# EAGLE design roland_121_vcf (EAGLE 7.6.0)
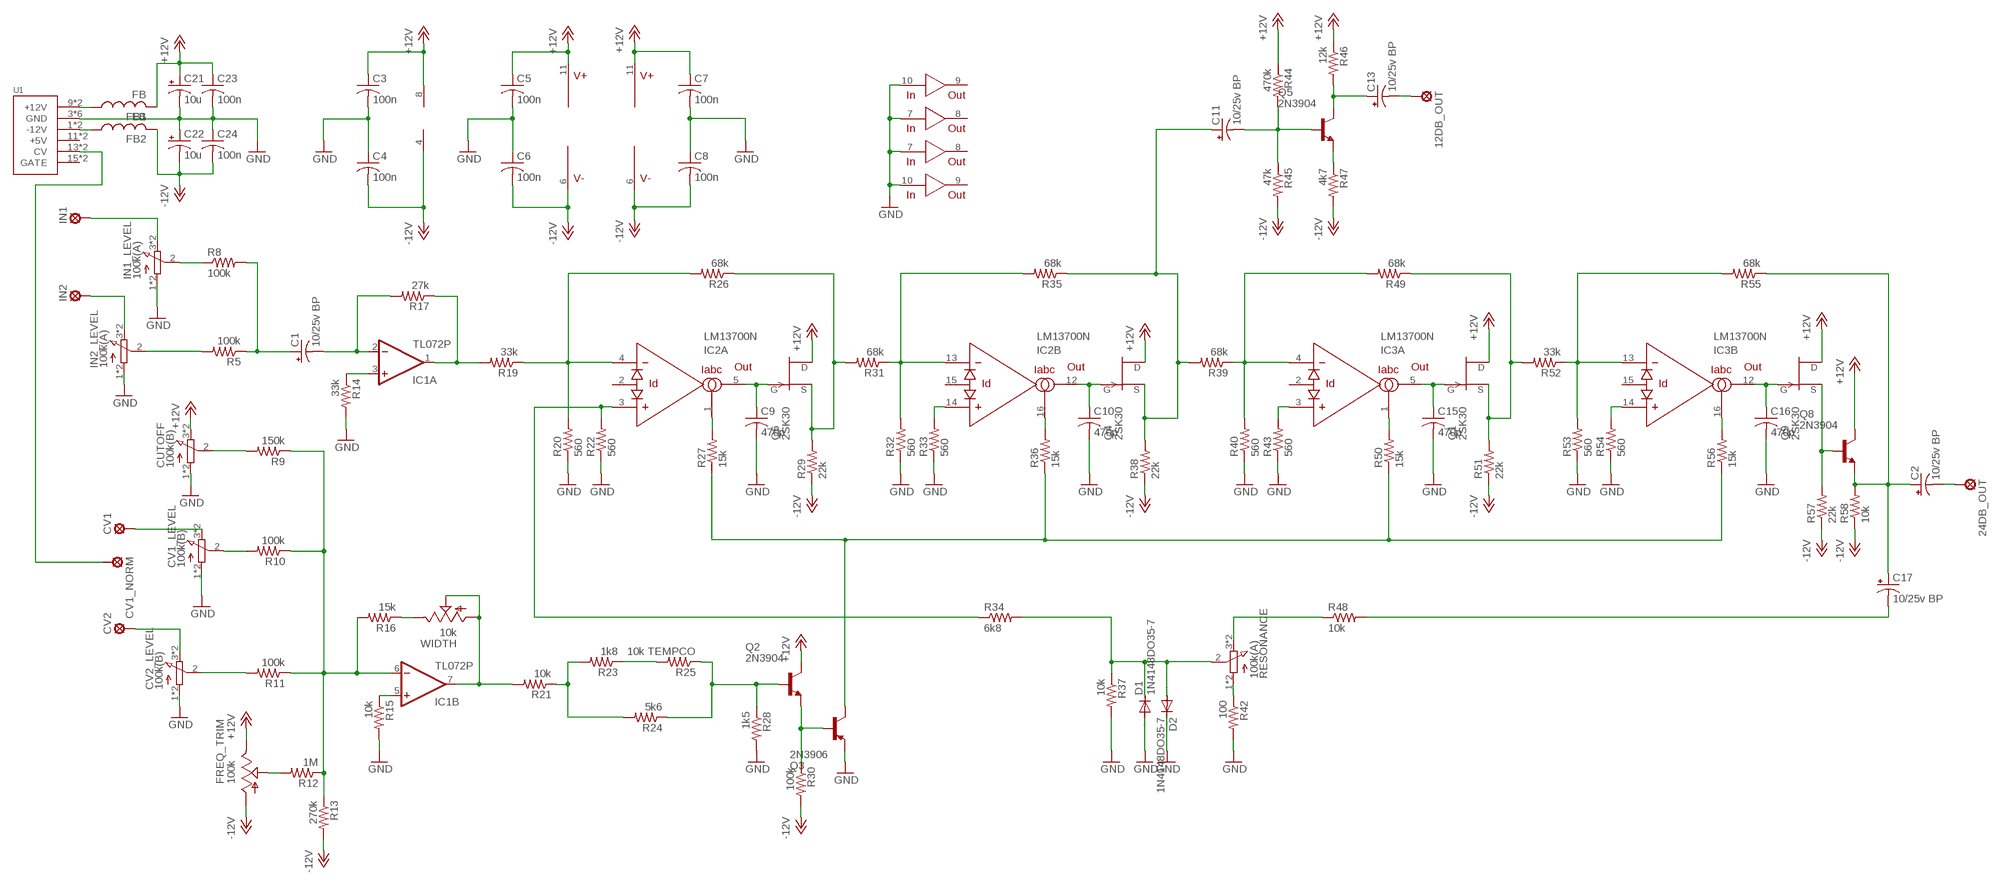
[diagram p0: schematic, sheet 1]

## Parts
12DB_OUT  LSP10  [LSP10]
24DB_OUT  LSP10  [LSP10]
C1  10/25v BP  CPOL-USB45181A  [B45181A]
C2  10/25v BP  CPOL-USB45181A  [B45181A]
C3  100n  C-USC1206  [C1206]
C4  100n  C-USC1206  [C1206]
C5  100n  C-USC1206  [C1206]
C6  100n  C-USC1206  [C1206]
C7  100n  C-USC1206  [C1206]
C8  100n  C-USC1206  [C1206]
C9  470p  C-US025-030X050  [C025-030X050]
C10  470p  C-US025-030X050  [C025-030X050]
C11  10/25v BP  CPOL-USB45181A  [B45181A]
C13  10/25v BP  CPOL-USB45181A  [B45181A]
C15  470p  C-US025-030X050  [C025-030X050]
C16  470p  C-US025-030X050  [C025-030X050]
C17  10/25v BP  CPOL-USB45181A  [B45181A]
C21  10u  CPOL-USB45181A  [B45181A]
C22  10u  CPOL-USB45181A  [B45181A]
C23  100n  C-US050-024X044  [C050-024X044]
C24  100n  C-US050-024X044  [C050-024X044]
CUTOFF  100k(B)  3RP/1610N  [3RP/1610N]
CV1  LSP10  [LSP10]
CV1_LEVEL  100k(B)  3RP/1610N  [3RP/1610N]
CV1_NORM  LSP10  [LSP10]
CV2  LSP10  [LSP10]
CV2_LEVEL  100k(B)  3RP/1610N  [3RP/1610N]
D1  1N4148DO35-7  [DO35-7]
D2  1N4148DO35-7  [DO35-7]
FB1  FB  [FB]
FB2  FB  [FB]
FREQ_TRIM  100k  TRIM_US-B64W  [B64W]
IC1  TL072P  [DIL08]
IC2  LM13700N  [DIL16]
IC3  LM13700N  [DIL16]
IN1  LSP10  [LSP10]
IN1_LEVEL  100k(A)  3RP/1610N  [3RP/1610N]
IN2  LSP10  [LSP10]
IN2_LEVEL  100k(A)  3RP/1610N  [3RP/1610N]
Q1  2SK30  [TO92]
Q2  2N3904  [TO92]
Q3  2N3906  [TO92]
Q4  2SK30  [TO92]
Q5  2N3904  [TO92]
Q6  2SK30  [TO92]
Q8  2N3904  [TO92]
Q9  2SK30  [TO92]
R5  100k  R-US_0207/7  [0207/7]
R8  100k  R-US_0207/7  [0207/7]
R9  150k  R-US_0207/7  [0207/7]
R10  100k  R-US_0207/7  [0207/7]
R11  100k  R-US_0207/7  [0207/7]
R12  1M  R-US_0207/7  [0207/7]
R13  270k  R-US_0207/7  [0207/7]
R14  33k  R-US_0207/7  [0207/7]
R15  10k  R-US_0207/7  [0207/7]
R16  15k  R-US_0207/7  [0207/7]
R17  27k  R-US_0207/7  [0207/7]
R19  33k  R-US_0207/7  [0207/7]
R20  560  R-US_0207/7  [0207/7]
R21  10k  R-US_0207/7  [0207/7]
R22  560  R-US_0207/7  [0207/7]
R23  1k8  R-US_0207/7  [0207/7]
R24  5k6  R-US_0207/7  [0207/7]
R25  10k TEMPCO  R-US_0207/7  [0207/7]
R26  68k  R-US_0207/7  [0207/7]
R27  15k  R-US_0207/7  [0207/7]
R28  1k5  R-US_0207/7  [0207/7]
R29  22k  R-US_0207/7  [0207/7]
R30  100k  R-US_0207/7  [0207/7]
R31  68k  R-US_0207/7  [0207/7]
R32  560  R-US_0207/7  [0207/7]
R33  560  R-US_0207/7  [0207/7]
R34  6k8  R-US_0207/7  [0207/7]
R35  68k  R-US_0207/7  [0207/7]
R36  15k  R-US_0207/7  [0207/7]
R37  10k  R-US_0207/7  [0207/7]
R38  22k  R-US_0207/7  [0207/7]
R39  68k  R-US_0207/7  [0207/7]
R40  560  R-US_0207/7  [0207/7]
R42  100  R-US_0207/7  [0207/7]
R43  560  R-US_0207/7  [0207/7]
R44  470k  R-US_0207/7  [0207/7]
R45  47k  R-US_0207/7  [0207/7]
R46  12k  R-US_0207/7  [0207/7]
R47  4k7  R-US_0207/7  [0207/7]
R48  10k  R-US_0207/7  [0207/7]
R49  68k  R-US_0207/7  [0207/7]
R50  15k  R-US_0207/7  [0207/7]
R51  22k  R-US_0207/7  [0207/7]
R52  33k  R-US_0207/7  [0207/7]
R53  560  R-US_0207/7  [0207/7]
R54  560  R-US_0207/7  [0207/7]
R55  68k  R-US_0207/7  [0207/7]
R56  15k  R-US_0207/7  [0207/7]
R57  22k  R-US_0207/7  [0207/7]
R58  10k  R-US_0207/7  [0207/7]
RESONANCE  100k(A)  3RP/1610N  [3RP/1610N]
U1  POWER  [POWER_16]
WIDTH  10k  TRIM_US-B64W  [B64W]

## Nets
+12V: C3.1 C5.1 C7.1 C21.+ C23.1 CUTOFF.3(E) CUTOFF.6(E) FB1.P$2 FREQ_TRIM.E IC1.8(P:V+) IC2.11(V+) IC3.11(V+) Q1.1(D) Q2.1(C) Q4.1(D) Q6.1(D) Q8.1(C) Q9.1(D) R44.1 R46.1
-12V: C4.2 C6.2 C8.2 C22.- C24.2 FB2.P$2 FREQ_TRIM.A IC1.4(P:V-) IC2.6(V-) IC3.6(V-) R13.2 R29.1 R30.2 R38.1 R45.2 R47.2 R51.1 R57.1 R58.1
GND: C3.2 C4.1 C5.2 C6.1 C7.2 C8.1 C9.2 C10.2 C15.2 C16.2 C21.- C22.+ C23.2 C24.1 CUTOFF.1(A) CUTOFF.4(A) CV1_LEVEL.1(A) CV1_LEVEL.4(A) CV2_LEVEL.1(A) CV2_LEVEL.4(A) D1.A D2.C IC2.7(IN) IC2.10(IN) IC3.7(IN) IC3.10(IN) IN1_LEVEL.1(A) IN1_LEVEL.4(A) IN2_LEVEL.1(A) IN2_LEVEL.4(A) Q3.3(E) R14.2 R15.2 R20.1 R22.1 R28.2 R32.1 R33.1 R37.2 R40.1 R42.2 R43.1 R53.1 R54.1 U1.3(GND) U1.4(GND) U1.5(GND) U1.6(GND) U1.7(GND) U1.8(GND)
N$1: IC2.1(A:IABC) R27.2
N$2: IC2.16(B:IABC) R36.2
N$3: IC2.13(B:-IN) R31.1 R32.2 R35.2
N$4: IC2.14(B:+IN) R33.2
N$5: IN2_LEVEL.2(S) R5.2
N$6: C1.+ R5.1 R8.2
N$7: C1.- IC1.2(A:-IN) R17.2
N$8: IC1.1(A:OUT) R17.1 R19.2
N$9: R16.1 WIDTH.E
N$10: CV2_LEVEL.2(S) R11.2
N$11: IC1.3(A:+IN) R14.1
N$12: IC1.5(B:+IN) R15.1
N$14: IC3.1(A:IABC) R50.2
N$15: IC3.4(A:-IN) R39.1 R40.2 R49.2
N$16: IC1.6(B:-IN) R9.1 R10.1 R11.1 R12.1 R13.1 R16.2
N$17: FREQ_TRIM.P$1(S) FREQ_TRIM.S R12.2
N$18: R23.1 R25.2
N$19: R21.1 R23.2 R24.2
N$20: Q2.2(B) R24.1 R25.1 R28.1
N$21: Q2.3(E) Q3.2(B) R30.1
N$22: IC2.4(A:-IN) R19.1 R20.2 R26.2
N$23: IC2.3(A:+IN) R22.2 R34.1
N$24: IC3.3(A:+IN) R43.2
N$25: IC3.16(B:IABC) R56.2
N$26: IC3.13(B:-IN) R52.1 R53.2 R55.2
N$27: IC3.14(B:+IN) R54.2
N$28: Q6.3(S) R26.1 R29.2 R31.2
N$29: 24DB_OUT.MP C2.-
N$30: 12DB_OUT.MP C13.-
N$31: Q5.3(E) R47.1
N$32: C13.+ Q5.1(C) R46.2
N$33: C11.- Q5.2(B) R44.2 R45.1
N$34: IN2.MP IN2_LEVEL.3(E) IN2_LEVEL.6(E)
N$35: C11.+ Q4.3(S) R35.1 R38.2 R39.2
N$36: C2.+ C17.+ Q8.3(E) R55.1 R58.2
N$37: Q1.3(S) R49.1 R51.2 R52.2
N$38: IC1.7(B:OUT) R21.2 WIDTH.A WIDTH.P$1(S) WIDTH.S
N$40: C9.1 IC2.5(A:OUT) Q6.2(G)
N$41: C10.1 IC2.12(B:OUT) Q4.2(G)
N$42: C15.1 IC3.5(A:OUT) Q1.2(G)
N$43: C16.1 IC3.12(B:OUT) Q9.2(G)
N$45: Q3.1(C) R27.1 R36.1 R50.1 R56.1
N$47: Q8.2(B) Q9.3(S) R57.2
N$48: R42.1 RESONANCE.1(A) RESONANCE.4(A)
N$50: C17.- R48.2
N$51: R48.1 RESONANCE.3(E) RESONANCE.6(E)
N$52: D1.C D2.A R34.2 R37.1 RESONANCE.2(S)
N$53: CV1_LEVEL.2(S) R10.2
N$54: CV2.MP CV2_LEVEL.3(E) CV2_LEVEL.6(E)
N$55: CV1_NORM.MP U1.13(CV) U1.14(CV)
N$56: CUTOFF.2(S) R9.2
N$57: IN1_LEVEL.2(S) R8.1
N$58: IN1.MP IN1_LEVEL.3(E) IN1_LEVEL.6(E)
N$59: CV1.MP CV1_LEVEL.3(E) CV1_LEVEL.6(E)
N$61: FB1.P$1 U1.9(+12V) U1.10(+12V)
N$62: FB2.P$1 U1.1(-12V) U1.2(-12V)
Unconnected: IC2.2(A:ID) IC2.8(OUT) IC2.9(OUT) IC2.15(B:ID) IC3.2(A:ID) IC3.8(OUT) IC3.9(OUT) IC3.15(B:ID) U1.11(+5V) U1.12(+5V) U1.15(GATE) U1.16(GATE)

## Library data of the parts
12DB_OUT 24DB_OUT CV1 CV1_NORM CV2 IN1 IN2 = solpad:LSP10: SOLDER PAD drill 1.0 mm, distributor Buerklin, 12H555
C1 C2 C11 C13 C17 C21 C22 = rcl:CPOL-US: POLARIZED CAPACITOR, American symbol
C3-C10 C15 C16 C23 C24 = rcl:C-US: CAPACITOR, American symbol
CUTOFF CV1_LEVEL CV2_LEVEL IN1_LEVEL IN2_LEVEL RESONANCE = pot:3RP/1610N: 16mm Potentiometer one level Source: http://www.alphapotentiometers.net/html/16mm_pot_2.html
D1 D2 = diode:1N4148: DIODE high speed (Philips)
FB1 FB2 = adafruit:FB: Ferrite bead Digikey #P9821BK-ND
FREQ_TRIM WIDTH = pot:TRIM_US-: POTENTIOMETER
IC1 = linear:TL072: OP AMP
IC2 IC3 = synthdiy updated imperial:LM13700: National Dual OTA with buffers.
Q1 Q4 Q6 Q9 = 808:2SK30
Q2 Q5 Q8 = transistor-npn:2N3904: NPN Transistor
Q3 = transistor-pnp:2N3906: PNP Transistor
R5 R8-R17 R19-R40 R42-R58 = rcl:R-US_: RESISTOR, American symbol
U1 = eurorack:POWER

## Board
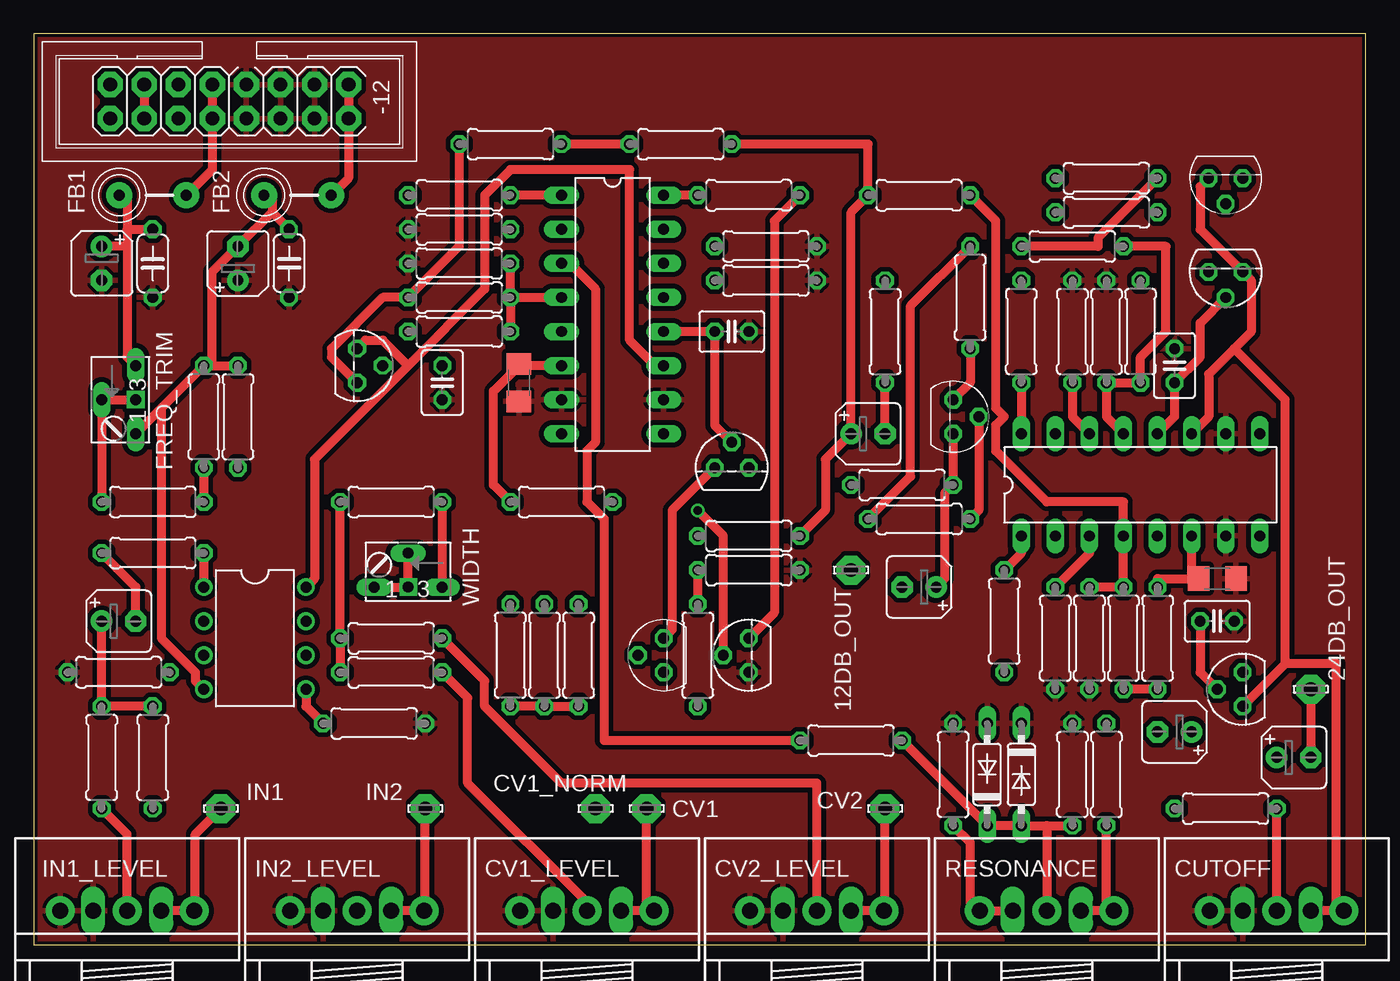
[diagram p1: board, top side]
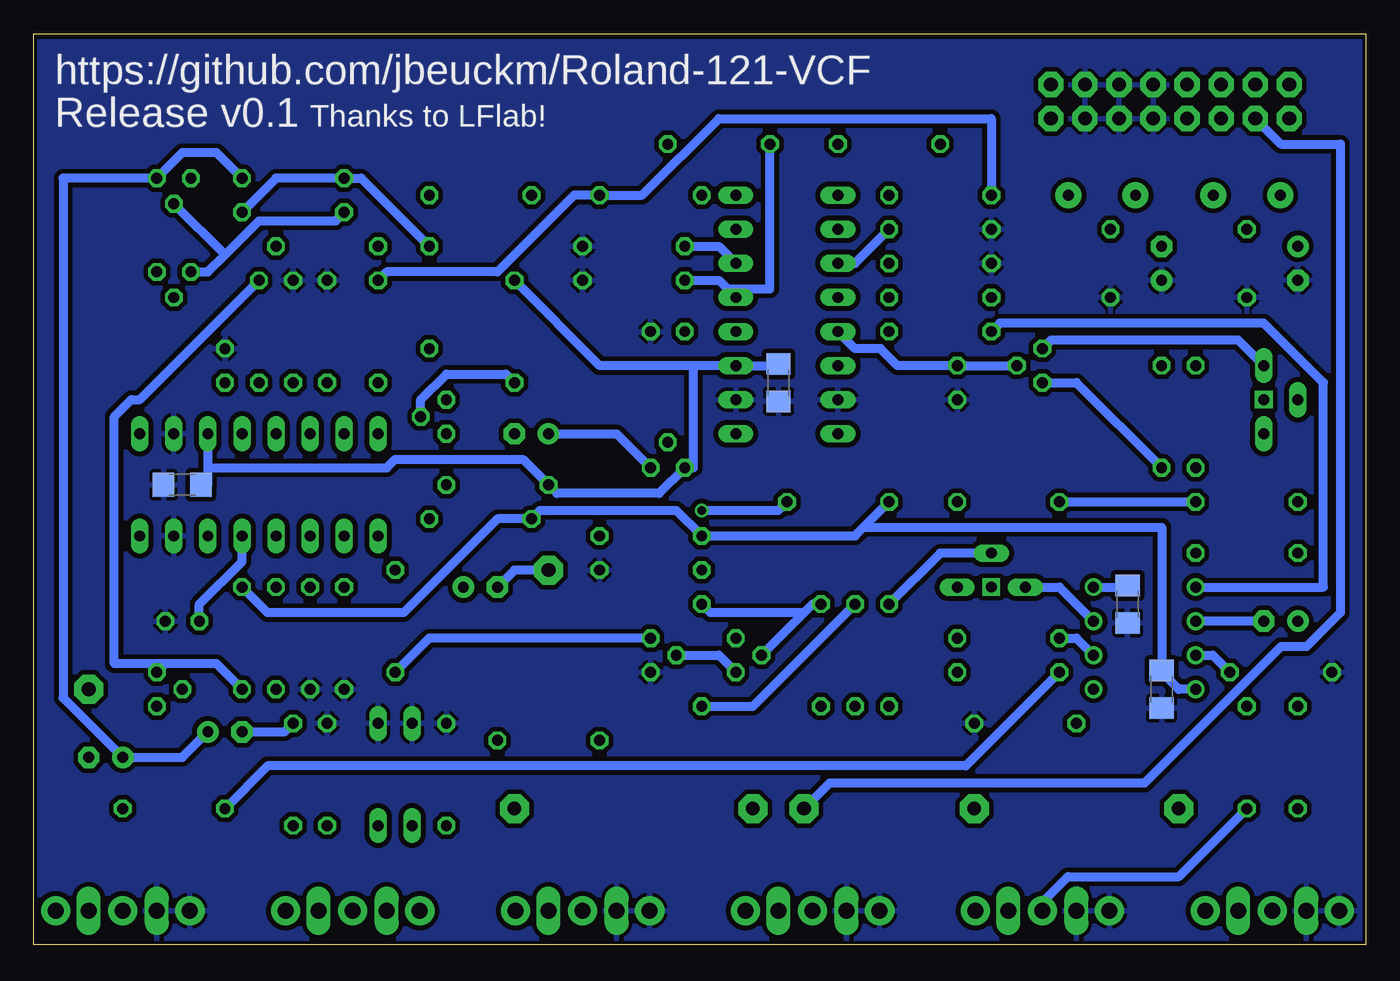
[diagram p2: board, bottom side, seen from below]

Size 99.36 x 67.94 mm. Coordinates in mm from the lower left corner, seen from the top.
Outline: 0,0 99.36,0 99.36,67.94 0,67.94 0,0
Copper layers (1*16): Top 0.035mm / dielectric 1.5mm / Bottom 0.035mm
Design rules "default *": minimum track width 26mil, minimum drill 24mil, track to track 14mil, track to pad 14mil, pad to pad 14mil, via to via 14mil, smd to smd 8mil, copper to edge 10mil, drill to drill 12mil, minimum pad ring 10mil, minimum via ring 8mil, stop-mask expansion 4mil, vias tented up to drill 0mil, thermal gap 10mil

### Footprints (pad centres in the part's own frame; a part is rotated, then mirrored left to right if it is on the bottom)
LSP10 = drill 1.016 pad 2.159 octagon: MP 0,0
B45181A = drill 0.813 pad 1.6: + -1.27,0 | drill 0.813 pad 1.6 octagon: - 1.27,0
C1206 = smd 1.6 x 1.8: 1 -1.4,0; 2 1.4,0
C025-030X050 = drill 0.813 octagon: 1 -1.27,0; 2 1.27,0
C050-024X044 = drill 0.813 octagon: 1 -2.54,0; 2 2.54,0
3RP/1610N = drill 1.2 pad 2.184: 1 -5,0; 2 0,0; 3 5,0 | drill 1.2 long: 4 -2.54,0; 6 2.54,0
DO35-7 = drill 0.813 long: A 3.81,0; C -3.81,0
FB = drill 0.8 pad 1.93: P$1 -2.5,0; P$2 2.5,0
B64W = drill 0.813 long: A 2.54,0; E -2.54,0; S 0,-2.54 | drill 0.8 square: P$1 0,0
DIL08 = drill 0.813 pad 1.27: 1 -3.81,-3.81; 2 -1.27,-3.81; 3 1.27,-3.81; 4 3.81,-3.81; 5 3.81,3.81; 6 1.27,3.81; 7 -1.27,3.81; 8 -3.81,3.81
DIL16 = drill 0.813 long: 1 -8.89,-3.81; 2 -6.35,-3.81; 3 -3.81,-3.81; 4 -1.27,-3.81; 5 1.27,-3.81; 6 3.81,-3.81; 7 6.35,-3.81; 8 8.89,-3.81; 9 8.89,3.81; 10 6.35,3.81; 11 3.81,3.81; 12 1.27,3.81; 13 -1.27,3.81; 14 -3.81,3.81; 15 -6.35,3.81; 16 -8.89,3.81
TO92 = drill 0.813 octagon: 1 -1.27,0; 2 0,1.905; 3 1.27,0
TO92' = drill 0.813 octagon: 1 1.27,0; 2 0,1.905; 3 -1.27,0
0207/7 = drill 0.813 octagon: 1 -3.81,0; 2 3.81,0
POWER_16 = drill 1.016 pad 1.88 octagon: 1 -6.35,-1.27; 2 -6.35,1.27; 3 -3.81,-1.27; 4 -3.81,1.27; 5 -1.27,-1.27; 6 -1.27,1.27; 7 1.27,-1.27; 8 1.27,1.27; 9 3.81,-1.27; 10 3.81,1.27; 11 6.35,-1.27; 12 6.35,1.27; 13 8.89,-1.27; 14 8.89,1.27; 15 11.43,-1.27; 16 11.43,1.27

### Placement (x,y rotation side)
12DB_OUT  60.96,27.94 0 top
24DB_OUT  95.25,19.05 0 top
C1  6.35,24.13 0 top
C2  93.98,13.97 0 top
C3  17.78,25.4 270 bottom
C4  15.24,19.05 90 bottom
C5  43.81,41.91 270 bottom
C6  36.2,41.91 90 top
C7  88.27,34.29 180 bottom
C8  88.27,27.3 180 top
C9  30.48,41.91 270 top
C10  52.07,45.72 0 top
C11  62.23,38.1 0 top
C13  66.04,26.67 180 top
C15  88.27,24.13 0 top
C16  85.09,43.18 90 top
C17  85.09,15.88 180 top
C21  5.08,50.8 270 top
C22  15.24,50.8 90 top
C23  8.89,50.8 270 top
C24  19.05,50.8 90 top
CUTOFF  92.71,2.54 0 top
CV1  45.72,10.16 0 top
CV1_LEVEL  41.27,2.54 0 top
CV1_NORM  41.91,10.16 0 top
CV2  63.5,10.16 0 top
CV2_LEVEL  58.42,2.54 0 top
D1  71.12,12.7 90 top
D2  73.66,12.7 270 top
FB1  8.89,55.88 180 top
FB2  19.68,55.88 180 top
FREQ_TRIM  7.62,40.64 270 top
IC1  16.51,22.86 270 top
IC2  43.18,46.99 270 top
IC3  82.55,34.29 0 top
IN1  13.97,10.16 0 top
IN1_LEVEL  6.99,2.54 0 top
IN2  29.21,10.16 0 top
IN2_LEVEL  24.13,2.54 0 top
Q1  90.17,19.05 90 top
Q2  2N3904  [TO92']  46.99,21.59 90 top
Q3  2N3906  [TO92']  53.34,21.59 90 top
Q4  52.07,35.56 0 top
Q5  2N3904  [TO92']  68.58,39.37 270 top
Q6  24.13,43.18 270 top
Q8  2N3904  [TO92']  88.9,57.15 180 top
Q9  88.9,50.16 180 top
R5  8.89,13.97 270 top
R8  5.08,13.97 90 top
R9  88.9,10.16 0 top
R10  26.67,20.32 0 top
R11  26.67,22.86 0 top
R12  8.89,33.02 180 top
R13  12.7,39.37 90 top
R14  6.35,20.32 180 top
R15  25.4,16.51 0 top
R16  26.67,33.02 180 top
R17  8.89,29.21 180 top
R19  31.75,45.72 180 top
R20  31.75,50.8 0 top
R21  35.56,21.59 90 top
R22  31.75,53.34 0 top
R23  38.1,21.59 270 top
R24  40.64,21.59 270 top
R25  49.53,21.59 270 top
R26  31.75,48.26 0 top
R27  31.75,55.88 0 top
R28  53.34,27.94 0 top
R29  15.24,39.37 270 top
R30  39.37,33.02 180 top
R31  35.56,59.69 180 top
R32  54.61,49.53 180 top
R33  54.61,52.07 180 top
R34  60.96,15.24 0 top
R35  48.26,59.69 180 top
R36  53.34,55.88 180 top
R37  77.47,12.7 90 top
R38  53.34,30.48 0 top
R39  66.04,55.88 180 top
R40  78.74,22.86 90 top
R42  68.58,12.7 90 top
R43  76.2,22.86 90 top
R44  63.5,45.72 270 top
R45  66.04,31.75 180 top
R46  64.77,34.29 0 top
R47  69.85,48.26 90 top
R48  80.01,12.7 90 top
R49  81.28,22.86 90 top
R50  72.39,24.13 90 top
R51  83.82,22.86 270 top
R52  82.55,45.72 90 top
R53  80.01,45.72 270 top
R54  77.47,45.72 270 top
R55  77.47,52.07 0 top
R56  73.66,45.72 270 top
R57  80.01,54.61 180 top
R58  80.01,57.15 0 top
RESONANCE  75.56,2.54 0 top
U1  17.14,62.87 180 top
WIDTH  27.94,26.67 180 top

### Tracks (layer width: path | path; a pad name or v marks a point on that pad's centre or on a via)
+12V
  Top 0.66: FREQ_TRIM.E 6.99,43.81 6.99,52.07 | 6.99,53.34 6.99,55.88 FB1.P$2 | 6.99,53.34 6.99,52.07 | 6.99,53.34 C23.1 | 6.99,52.07 C21.+ | IC1.8 20.95,27.3 20.95,36.2 27.94,43.18 | 27.94,43.18 26.04,45.09 24.77,45.09 Q6.1 | Q2.1 47.62,23.5 47.62,32.38 Q4.1 | Q8.1 87,56.52 87,53.34 Q9.1 90.81,49.53 90.81,45.72 89.53,44.45 | IC3.11 87.63,39.37 87.63,42.55 89.53,44.45 | 93.34,20.95 Q1.1 | 93.34,20.95 97.16,20.95 97.16,2.54 | 97.16,2.54 CUTOFF.6 | 97.16,2.54 CUTOFF.3 | 89.53,44.45 93.34,40.64 93.34,20.95 | 27.94,43.18 33.66,48.9 33.66,55.88 35.56,57.78 44.45,57.78 44.45,45.09 46.35,43.18 IC2.11
  Bottom 0.66: IC1.8 17.78,26.67 C3.1 | Q6.1 23.5,45.09 9.53,45.09 FREQ_TRIM.E | C5.1 43.81,43.18 IC2.11 50.16,43.18 | R44.1 57.15,43.18 50.16,43.18 | 50.16,43.18 50.16,35.56 Q4.1 52.7,33.66 60.33,33.66 R46.1 62.87,36.2 72.39,36.2 73.03,35.56 86.36,35.56 | IC3.11 86.36,35.56 | 86.36,35.56 86.36,34.29 C7.1
-12V
  Top 0.66: 17.78,54.61 C24.2 | 17.78,54.61 17.78,55.88 FB2.P$2 | 17.78,54.61 C22.- 13.34,50.16 13.34,43.18 | 9.53,40.01 R13.2 13.34,43.18 | 9.53,40.01 FREQ_TRIM.A | 13.34,43.18 R29.1 | IC1.4 12.06,19.68 12.06,20.32 9.53,22.86 9.53,40.01 | 86.36,27.3 83.82,27.3 R51.1 | 86.36,27.3 IC3.6 | 86.36,27.3 C8.2 | IC2.6 36.2,43.18 | 36.2,43.18 34.29,41.27 34.29,34.29 R30.2 | 36.2,43.18 C6.2 | R47.2 65.41,47.62 65.41,34.92 R45.2
  Bottom 0.66: IC1.4 13.97,19.05 15.24,20.32 C4.2 15.24,31.11 37.47,31.11 | R47.2 74.93,57.15 R58.1 81.28,57.15 R57.1 | 37.47,31.11 38.1,30.48 R38.1 51.44,32.38 61.59,32.38 R45.2 64.77,31.75 71.75,24.77 81.92,24.77 R51.1 | 37.47,31.11 R30.2
GND
  pour Bottom: 0,67.31 99.06,67.31 99.06,0 0,0
  pour Top: -0.64,67.94 99.69,67.94 99.69,-0.64 -0.64,-0.64
N$1
  Top 0.66: IC2.1 R27.2
N$2
  Top 0.66: R36.2 IC2.16
N$3
  Top 0.66: R35.2 R31.1
  Bottom 0.66: 47.62,48.9 48.26,49.53 R32.2 | R35.2 44.45,48.9 47.62,48.9 | 47.62,48.9 IC2.13
N$4
  Bottom 0.66: IC2.14 48.26,52.07 R33.2
N$5
  Bottom 0.66: R5.2 13.97,5.08 22.23,5.08 24.13,3.17 IN2_LEVEL.2
N$6
  Top 0.66: R5.1 R8.2 C1.+
N$7
  Top 0.66: R17.2 7.62,26.67 C1.-
  Bottom 0.66: C1.- IC1.2
N$8
  Top 0.66: R17.1 IC1.1
  Bottom 0.66: R19.2 27.3,46.35 7.62,46.35 3.17,41.91 3.17,26.67 IC1.1
N$9
  Top 0.66: R16.1 WIDTH.E
N$10
  Top 0.66: R11.2 33.66,19.68 33.66,17.78 39.37,12.06 58.42,12.06 CV2_LEVEL.2
N$11
  Bottom 0.66: R14.1 11.43,21.59 IC1.3
N$12
  Top 0.66: R15.1 20.32,17.78 IC1.5
N$14
  Top 0.66: R50.2 73.66,29.21 IC3.1
N$15
  Top 0.66: R40.2 R49.2 IC3.4 81.28,33.02 75.56,33.02 71.75,36.83 71.75,38.73 72.39,39.37 71.75,40.01 71.75,53.98 R39.1
N$16
  Top 0.66: R13.1 R12.1 | R10.1 R11.1 R16.2
  Bottom 0.66: IC1.6 21.59,22.86 R11.1 | R9.1 81.92,13.34 29.84,13.34 R10.1 | R16.2 R12.1
N$17
  Top 0.66: FREQ_TRIM.P$1 FREQ_TRIM.S R12.2
N$18
  Bottom 0.66: R23.1 45.72,17.78 R25.2
N$19
  Top 0.66: R21.1 R23.2 R24.2
N$20
  Top 0.66: R28.1 R25.1
  Bottom 0.66: 41.91,24.77 41.27,25.4 R24.1 | 41.91,24.77 Q2.2 | R25.1 48.9,24.77 41.91,24.77
N$21  (via drill 0.61)
  Top 0.66: v49.53,32.38 51.44,30.48 Q3.2
  Bottom 0.66: Q2.3 48.26,21.59 Q3.2 | R30.1 43.81,32.38 v49.53,32.38
N$22
  Top 0.66: R26.2 R19.1 | R26.2 R20.2 | R26.2 IC2.4
N$23
  Top 0.66: R34.1 42.55,15.24 42.55,31.75 41.27,33.02 41.27,36.83 41.91,37.47 41.91,48.9 40.01,50.8 IC2.3
  Bottom 0.66: R22.2 38.1,50.8 IC2.3
N$24
  Top 0.66: R43.2 78.74,29.21 IC3.3
N$25
  Top 0.66: R56.2 IC3.16
N$26
  Top 0.66: IC3.13 80.01,39.37 R53.2 R52.1 82.55,43.81 84.45,45.72 84.45,52.07 R55.2
N$27
  Top 0.66: IC3.14 77.47,39.37 R54.2
N$28
  Top 0.66: R31.2 31.75,52.07 R26.1 26.04,48.26 22.23,44.45 22.23,43.81 Q6.3
  Bottom 0.66: R29.2 21.59,41.91 Q6.3
N$29
  Top 0.66: 24DB_OUT.MP C2.-
N$30
  Bottom 0.66: C13.- 63.5,27.94 12DB_OUT.MP
N$31
  Top 0.66: Q5.3 69.85,41.91 R47.1
N$32
  Top 0.66: Q5.1 R46.2 67.94,33.66 67.94,27.3 C13.+
N$33
  Top 0.66: C11.- R44.2 | R45.1 70.48,32.38 Q5.2
  Bottom 0.66: R44.2 64.14,42.55 68.58,42.55 70.48,40.64 Q5.2
N$34
  Top 0.66: IN2_LEVEL.6 IN2_LEVEL.3 29.21,2.54 IN2.MP
N$35
  Top 0.66: R35.1 62.23,59.69 R39.2 60.96,54.61 C11.+ 59.05,36.2 59.05,32.38 R38.2
  Bottom 0.66: Q4.3 55.88,38.1 C11.+
N$36
  Top 0.66: R55.1 79.38,52.07 79.38,52.7 R58.2
  Bottom 0.66: C17.+ 88.27,13.97 C2.+ 97.16,18.41 97.16,57.15 Q8.3 88.27,59.05 85.72,59.05 R58.2
N$37
  Top 0.66: R51.2 R49.1
  Bottom 0.66: 89.53,20.95 Q1.3 | 89.53,20.95 85.72,20.95 R51.2 | R52.2 91.44,40.64 92.08,40.64 93.34,39.37 93.34,20.95 89.53,20.95
N$38
  Top 0.66: WIDTH.A WIDTH.P$1 WIDTH.S
  Bottom 0.66: IC1.7 22.86,26.67 WIDTH.A | R21.2 31.75,29.21 WIDTH.S
N$40
  Bottom 0.66: Q6.2 C9.1 34.92,43.18 36.2,44.45 38.1,44.45 IC2.5
N$41
  Top 0.66: IC2.12 C10.1 50.8,38.73 Q4.2
N$42
  Top 0.66: Q1.2 87,20.32 C15.1
  Bottom 0.66: IC3.5 83.82,28.57 87,25.4 C15.1
N$43
  Top 0.66: IC3.12 85.09,39.37 C16.1 87,43.81 87,46.35 Q9.2
N$45
  Top 0.66: Q3.1 55.24,24.77 55.24,53.98 R36.1
  Bottom 0.66: R50.1 69.85,22.86 Q3.1 | R27.1 27.94,61.59 48.26,61.59 53.98,55.88 R36.1 59.05,55.88 64.77,50.16 73.03,50.16 R56.1
N$47
  Bottom 0.66: R57.2 76.83,53.98 82.55,53.98 85.09,51.44 | 85.09,51.44 86.36,50.16 Q9.3 | 85.09,51.44 Q8.2
N$48
  Top 0.66: R42.1 69.85,7.62 69.85,3.17 70.48,2.54 RESONANCE.1 RESONANCE.4
N$50
  Bottom 0.66: R48.2 80.64,15.88 C17.-
N$51
  Top 0.66: 80.01,2.54 R48.1 | 80.01,2.54 RESONANCE.6 | 80.01,2.54 RESONANCE.3
N$52
  Top 0.66: 75.56,8.89 D2.A D1.C R34.2 | 75.56,8.89 R37.1 | 75.56,8.89 RESONANCE.2
N$53
  Top 0.66: R10.2 32.38,18.41 32.38,12.06 41.27,3.17 CV1_LEVEL.2
N$54
  Top 0.66: CV2_LEVEL.6 CV2_LEVEL.3 63.5,2.54 CV2.MP
N$55
  Top 0.66: U1.13 U1.14
  Bottom 0.66: CV1_NORM.MP 40.01,12.06 16.51,12.06 6.35,22.23 4.45,22.23 1.91,24.77 1.91,59.69 6.35,59.69 U1.14
N$56
  Top 0.66: CUTOFF.2 R9.2
N$57
  Top 0.66: R8.1 6.99,8.26 IN1_LEVEL.2
N$58
  Top 0.66: IN1_LEVEL.6 IN1_LEVEL.3 12.06,2.54 12.06,8.26 IN1.MP
N$59
  Top 0.66: 45.72,2.54 CV1_LEVEL.6 | 45.72,2.54 CV1.MP | 45.72,2.54 CV1_LEVEL.3
N$61
  Top 0.66: U1.9 U1.10 13.34,57.78 11.43,55.88 FB1.P$1
N$62
  Top 0.66: U1.1 U1.2 23.5,57.15 22.23,55.88 FB2.P$1

### Text on the board
bNames: https://github.com/jbeuckm/Roland-121-VCF | Thanks to LFlab! | Release v0.1